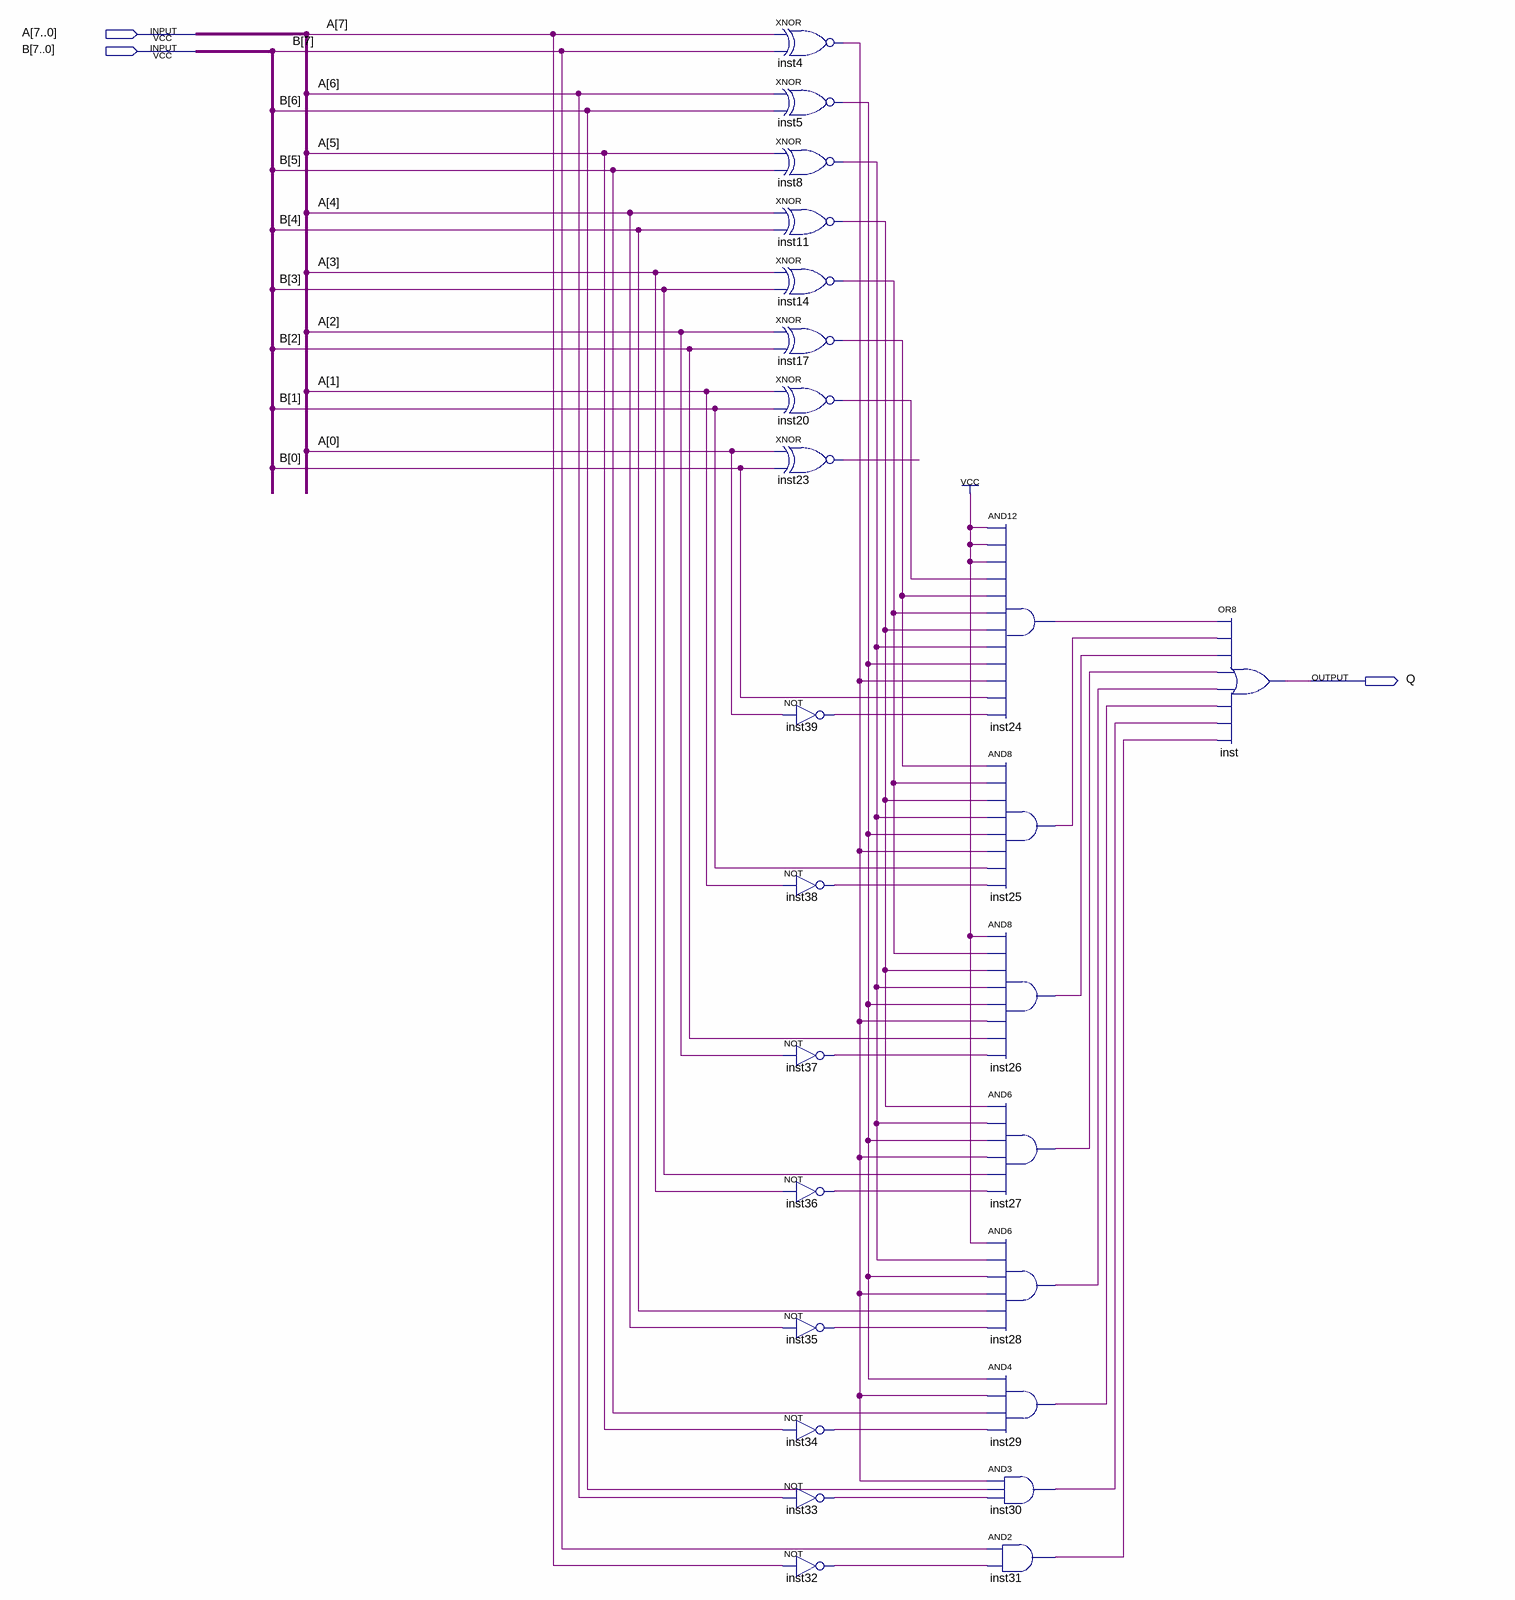
[diagram p0: schematic sheet]
// Quartus schematic comparator_8b.bdf as structural Verilog: 25 symbols, 3 pins
module comparator_8b (
  input  [7:0] A,
  input  [7:0] B,
  output Q
);

  wire inst4_out, inst5_out, inst8_out, inst11_out, inst14_out, inst17_out, inst20_out, inst23_out,
       inst24_out, inst25_out, inst26_out, inst27_out, inst28_out, inst29_out, inst30_out, inst31_out,
       inst32_out, inst33_out, inst34_out, inst35_out, inst36_out, inst37_out, inst38_out, inst39_out;

  xnor inst4 (inst4_out, A[7], B[7]);
  xnor inst5 (inst5_out, A[6], B[6]);
  xnor inst8 (inst8_out, A[5], B[5]);
  xnor inst11 (inst11_out, A[4], B[4]);
  xnor inst14 (inst14_out, A[3], B[3]);
  xnor inst17 (inst17_out, A[2], B[2]);
  xnor inst20 (inst20_out, A[1], B[1]);
  xnor inst23 (inst23_out, A[0], B[0]);
  not inst39 (inst39_out, A[0]);
  not inst38 (inst38_out, A[1]);
  not inst37 (inst37_out, A[2]);
  not inst36 (inst36_out, A[3]);
  not inst35 (inst35_out, A[4]);
  not inst34 (inst34_out, A[5]);
  not inst33 (inst33_out, A[6]);
  not inst32 (inst32_out, A[7]);
  and inst24 (inst24_out, 1'b1, 1'b1, 1'b1, inst20_out, inst17_out, inst14_out, inst11_out, inst8_out, inst5_out, inst4_out, B[0], inst39_out);
  and inst25 (inst25_out, inst17_out, inst14_out, inst11_out, inst8_out, inst5_out, inst4_out, B[1], inst38_out);
  and inst26 (inst26_out, 1'b1, inst14_out, inst11_out, inst8_out, inst5_out, inst4_out, B[2], inst37_out);
  and inst27 (inst27_out, inst11_out, inst8_out, inst5_out, inst4_out, B[3], inst36_out);
  and inst28 (inst28_out, 1'b1, inst8_out, inst5_out, inst4_out, B[4], inst35_out);
  and inst29 (inst29_out, inst5_out, inst4_out, B[5], inst34_out);
  and inst30 (inst30_out, inst4_out, B[6], inst33_out);
  and inst31 (inst31_out, B[7], inst32_out);
  or inst (Q, inst24_out, inst25_out, inst26_out, inst27_out, inst28_out, inst29_out, inst30_out, inst31_out);
endmodule
